# Altium project GPS_IMU.PrjPcb
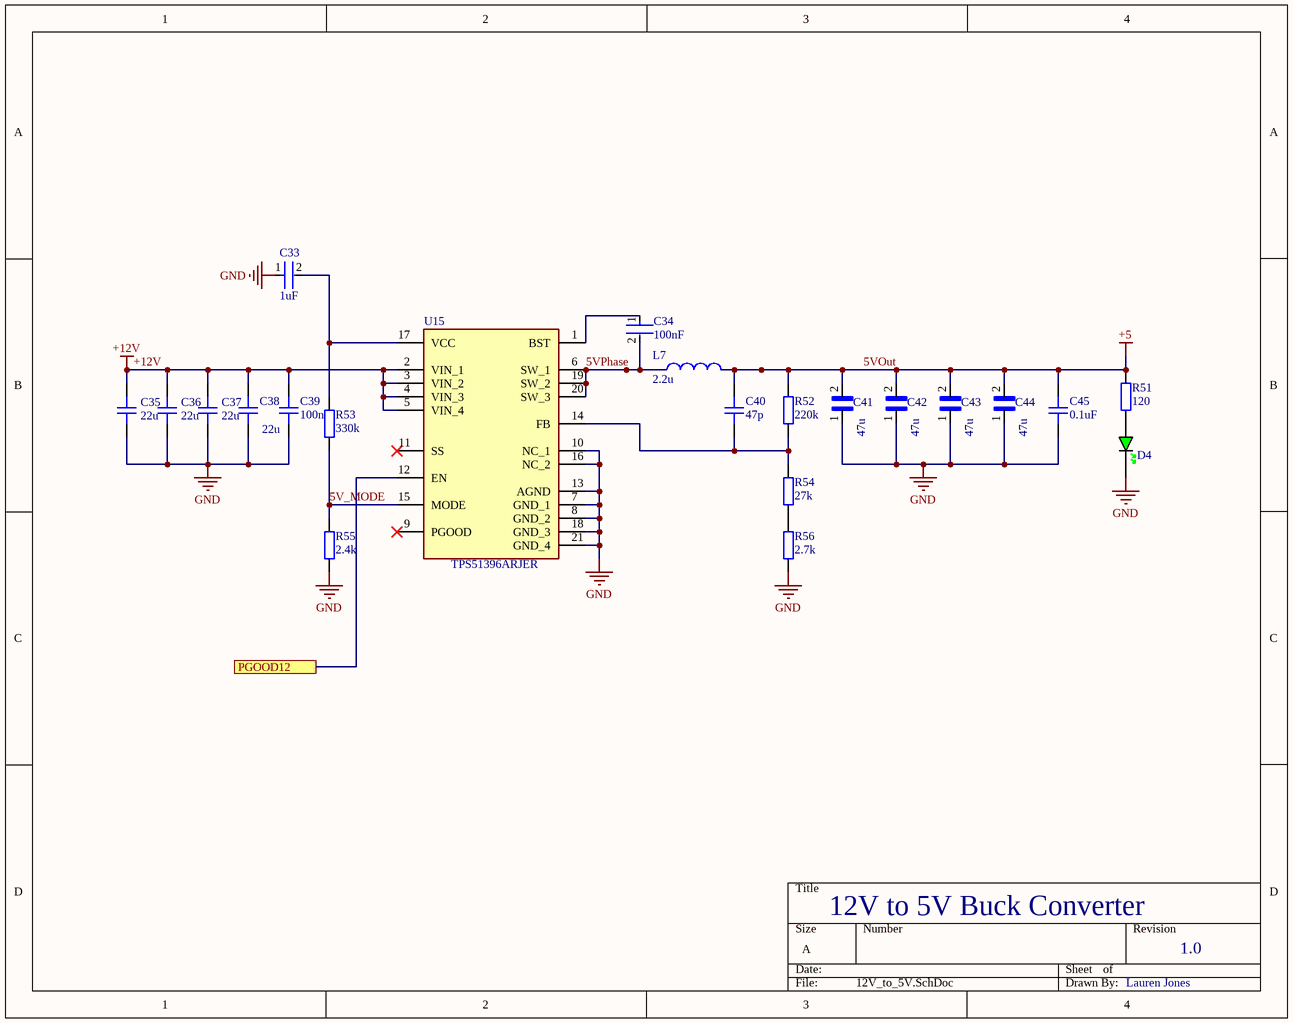
[diagram p0: 12V_to_5V.SchDoc]
5 sheets, 120 parts. Net scope: flat (ports and power ports of the same name join across sheets).
Sheets:
  12V_to_5V.SchDoc
  5V_to_3V_LDO.SchDoc
  STM32.SchDoc
  USB.SchDoc
  GPS.SchDoc

## Sheet 12V_to_5V.SchDoc
size A; SheetNumber: 1; SheetTotal: 4

### Parts
(Parts that share a designator on the sheet are numbered #1, #2 ... from top to bottom, then left to right.)
C33  1uF  [FP-CL283-IPC_C]
C34  100nF  [FP-CC0603-DA-MFG]
C35  22u  [CAP_0805]
C36  22u  [CAP_0805]
C37  22u  [CAP_0805]
C38  22u  [CAP_0805]
C39  100n  [CAP_0603]
C40  47p  [CAP_0402]
C41  47u  [CAP_CGA9N3X7R1C476M230KB]
C42  47u  [CAP_CGA9N3X7R1C476M230KB]
C43  47u  [CAP_CGA9N3X7R1C476M230KB]
C44  47u  [CAP_CGA9N3X7R1C476M230KB]
C45  0.1uF  [CAP_1206]
D4#1  GREEN  [LED_0805_GREEN]  (value not drawn)
L7  2.2u  [IND_SPM10040T-2R2M-HZ]
R51  120  [RES_0805]
R52  220k  [RES_0603]
R53  330k  [RES_0603]
R54  27k  [RES_0603]
R55  2.4k  [RES_0603]
R56  2.7k  [RES_0603]
U15  TPS51396ARJER  [TPS51396ARJER]

### Ports
PGOOD12

### Nets
5VOut: C40.2 C41.2 C42.2 C43.2 C44.2 C45.2 L7.2 R51.2 R52.2  [also labelled +5]
+12V: C35.2 C36.2 C37.2 C38.2 C39.2 U15.2(VIN_1) U15.3(VIN_2) U15.4(VIN_3) U15.5(VIN_4)
GND: C33.1 C35.1 C36.1 C37.1 C38.1 C39.1 C41.1 C42.1 C43.1 C44.1 C45.1 D4#1.K R55.1 R56.1 U15.7(GND_1) U15.8(GND_2) U15.10(NC_1) U15.13(AGND) U15.16(NC_2) U15.18(GND_3) U15.21(GND_4)
5V_MODE: R53.1 R55.2 U15.15(MODE)
5VPhase: C34.2 L7.1 U15.6(SW_1) U15.19(SW_2) U15.20(SW_3)
NetC33_2: C33.2 R53.2 U15.17(VCC)
NetC34_1: C34.1 U15.1(BST)
NetC40_1: C40.1 R52.1 R54.2 U15.14(FB)
NetD4#1_A: D4#1.A R51.1
NetR54_1: R54.1 R56.2
NetU15_12: U15.12(EN) ; port PGOOD12

Not connected (* = marked no-connect by the designer): U15 9(PGOOD)* 11(SS)*

### Notes on the sheet
- 12V to 5V Buck Converter
- 1.0
- Lauren Jones

### Library data of the parts
C33 = CMP-13271-003018-1: Cap Ceramic 4.7uF 6.3V X5R ±20% SMD 0402 +85°C Paper T/R; Lead Free: Lead Free; Voltage Rating: 6.3V; Case Code (Metric): 1005; Package Quantity: 1; Capacitance: 4.7uF; Length: 0.039inch; Mount: Surface Mount; Radiation Hardening: No; Packaging: Tape and Reel; Tolerance: 20%; Max Operating Temperature: 85°C; Width: 0.02inch; Case Code (Imperial): 0402; Thickness: 0.022inch; Min Operating Temperature: -55°C; Dielectric: X5R; Case/Package: 0402; Depth: 0.5mm
C34 = CMP-2100-03601-2: CAP CER 0.1UF 50V X7R 0603 / CC0603KRX7R9BB104; Manufacturer: YAGEO; Material: Ceramic; Temperature Coefficient: 15%; Tolerance: 0.1; Height: 0.9mm; Voltage: 50 V; ComponentLink2Description: Datasheet; Device Class L2: Capacitors; Temperature Range High: +125°C; Category: Cap; Capacitance: 100 nF; Footprint Url: http://www.yageo.com/exep/pages/download/literatures/UPY-C_GEN_24.pdf; ComponentLink2URL: http://www.yageo.com/documents/recent/UPY-GPHC_X7R_6.3V-to-50V_18.pdf; Package: CC0603-DA; Temperature: -55°C to +125°C; Voltage Rating: 50 V; Temperature Characteristic: X7R; Device Class L1: Passive Components; Temperature Range Low: -55°C; Manufacturer Part Number: CC0603KRX7R9BB104; RoHS: TRUE; Automotive: No; Value: 100 nF; Device Class L3: Ceramic Capacitors; Octopart: https://octopart.com/cc0603krx7r9bb104-yageo-42244635; Mouser Description: Multilayer Ceramic Capacitor, CC Series, 0.1 - F, - 10%, X7R, 50 V, 0603 [1608 Metric]; Lead Free: Yes; Digikey Description: CAP CER 0.1UF 50V X7R 0603
C35-C38 = CAP_0805: Capacitor SMD 0805; Manufacturer: *; Manufacturer Part Number: *; Distributor Link: *; LCSC: *; Rating: *; Dielectric: *
C39 = CAP_0603: Capacitor SMD 0603; Manufacturer: *; Manufacturer Part Number: *; Distributor Link: *; LCSC: *; Rating: *; Dielectric: *
C40 = CAP_0402: Capacitor SMD 0402; Manufacturer: *; Manufacturer Part Number: *; Distributor Link: *; LCSC: *; Rating: *; Dielectric: *
C41-C44 = CGA9N3X7R1C476M230KB: 47µF ±20% 16V Ceramic Capacitor X7R 2220 (5750 Metric); MF: TDK; SnapEDA_Link: https://www.snapeda.com/parts/CGA9N3X7R1C476M230KB/TDK/view-part/1756766/?ref=snap; MP: CGA9N3X7R1C476M230KB; Digi-Key_Part_Number: 445-7935-1-ND; Value: *; Mouser-Purchase-URL: https://snapeda.com/shop?store=Mouser&id=1756766; Package: 2220 TDK; DigiKey-Purchase-URL: https://snapeda.com/shop?store=DigiKey&id=1756766
C45 = CAP_1206: Capacitor SMD 1206; Manufacturer: *; Manufacturer Part Number: *; Distributor Link: *; LCSC: *; Rating: *; Dielectric: *
D4#1 = LED_0805_GREEN: KT-0805G; Manufacturer: *; Manufacturer Part Number: *; Distributor Link: *; LCSC: *
L7 = SPM10040T-2R2M-HZ: Inductor Power Shielded Wirewound 2.2uH 20% 100KHz Metal 16.7A 0.00748Ohm DCR Automotive T/R; MF: TDK; DigiKey_Part_Number: 445-180236-2-ND; Purchase-URL: https://pricing.snapeda.com/search?q=SPM10040T-2R2M-HZ&ref=eda; Package: NON STANDARD-2 TDK; Check_prices: https://www.snapeda.com/parts/SPM10040T-2R2M-HZ/TDK/view-part/?ref=eda; Value: *; SnapEDA_Link: https://www.snapeda.com/parts/SPM10040T-2R2M-HZ/TDK/view-part/?ref=snap; MP: SPM10040T-2R2M-HZ
R51 = RES_0805: Resistor SMD 0805; Manufacturer: *; Manufacturer Part Number: *; Distributor Link: *; LCSC: *
R52-R56 = RES_0603: Resistor SMD 0603; Manufacturer: *; Manufacturer Part Number: *; Distributor Link: *; LCSC: *
U15 = TPS51396ARJER: Buck Switching Regulator IC Positive Adjustable 0.6V 1 Output 8A 20-VFQFN Exposed Pad; Manufacturer_Name: Texas Instruments; Geometry.Height: 1mm; Mouser Part Number: 595-TPS51396ARJER; Mouser Price/Stock: https://www.mouser.co.uk/ProductDetail/Texas-Instruments/TPS51396ARJER?qs=GBLSl2AkirtKr8QWcQ0Vig%3D%3D; Manufacturer_Part_Number: TPS51396ARJER; Datasheet Link: https://www.ti.com/lit/ds/symlink/tps51396a.pdf?HQS=dis-mous-null-mousermode-dsf-pf-null-wwe&ts=1662566370253&ref_url=https%253A%252F%252Fwww.mouser.in%252F; LCSC Part #: C3032872

## Sheet 5V_to_3V_LDO.SchDoc
size A; SheetNumber: 6; SheetTotal: 7
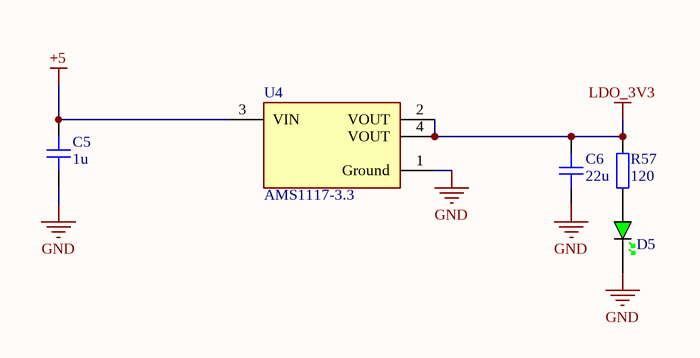
[diagram p1: 5V_to_3V_LDO.SchDoc]

### Parts
(Parts that share a designator on the sheet are numbered #1, #2 ... from top to bottom, then left to right.)
C5#1  1u  [CAP_0402]
C6#1  22u  [CAP_0402]
D5  GREEN  [LED_0805_GREEN]  (value not drawn)
R57  120  [RES_0805]
U4#1  AMS1117-3.3  [FP-AMS1117-IPC_C]

### Nets
+5: C5#1.2 U4#1.3(VIN)  [project net 5VOut]
GND: C5#1.1 C6#1.1 D5.K U4#1.1(Ground)
LDO_3V3: C6#1.2 R57.2 U4#1.2(VOUT) U4#1.4(VOUT)
NetD5_A: D5.A R57.1

### Library data of the parts
C5#1 C6#1 = CAP_0402: Capacitor SMD 0402; Manufacturer: *; Manufacturer Part Number: *; Distributor Link: *; Rating: *; Dielectric: *
  C5#1: LCSC: *; LCSC Part #: C52923
  C6#1: LCSC Part #: C1621763
D5 = LED_0805_GREEN: KT-0805G; Manufacturer: *; Manufacturer Part Number: *; Distributor Link: *; LCSC: *
R57 = RES_0805: Resistor SMD 0805; Manufacturer: *; Manufacturer Part Number: *; Distributor Link: *; LCSC: *
U4#1 = CMP-209535-000001-1: LDO Voltage Regulators 1A, 3.3V; Manufacturer: Advanced Monolithic Systems; Dropout Voltage: 1.1V; Output Type: Fixed; Nominal Supply Current: 5mA; Max Power Dissipation: 1.2W; Max Supply Voltage: 15V; Number Of Outputs: 1; Standoff Height: 0.64mm; Max Junction Temp: +125°C; Height: 1.8mm; Package: AMS1117; Device Class L2: Power Management ICs; ComponentLink2Description: Datasheet; ComponentLink2URL: http://www.advanced-monolithic.com/pdf/ds1117.pdf; Category: IC; RoHS: TRUE; Automotive: No; Device Class L1: Integrated Circuits (ICs); Output Current: 1A; Device Class L3: Voltage Regulators - Linear; Temperature: -40°C to +125°C; Output Voltage: 3.3V; Manufacturer Part Number: AMS1117-3.3; Temperature Range Low: -40°C; Octopart: https://octopart.com/ams1117-3.3-advanced+monolithic+systems-25899300; Lead Free: Yes; Ipc Land Pattern Name: SOT229P700X180-4; Temperature Range High: +125°C

## Sheet STM32.SchDoc
size 304 x 190 mm; Engineer: Morgan Jones; Revision: 1.0; SheetNumber: 3; SheetTotal: 3
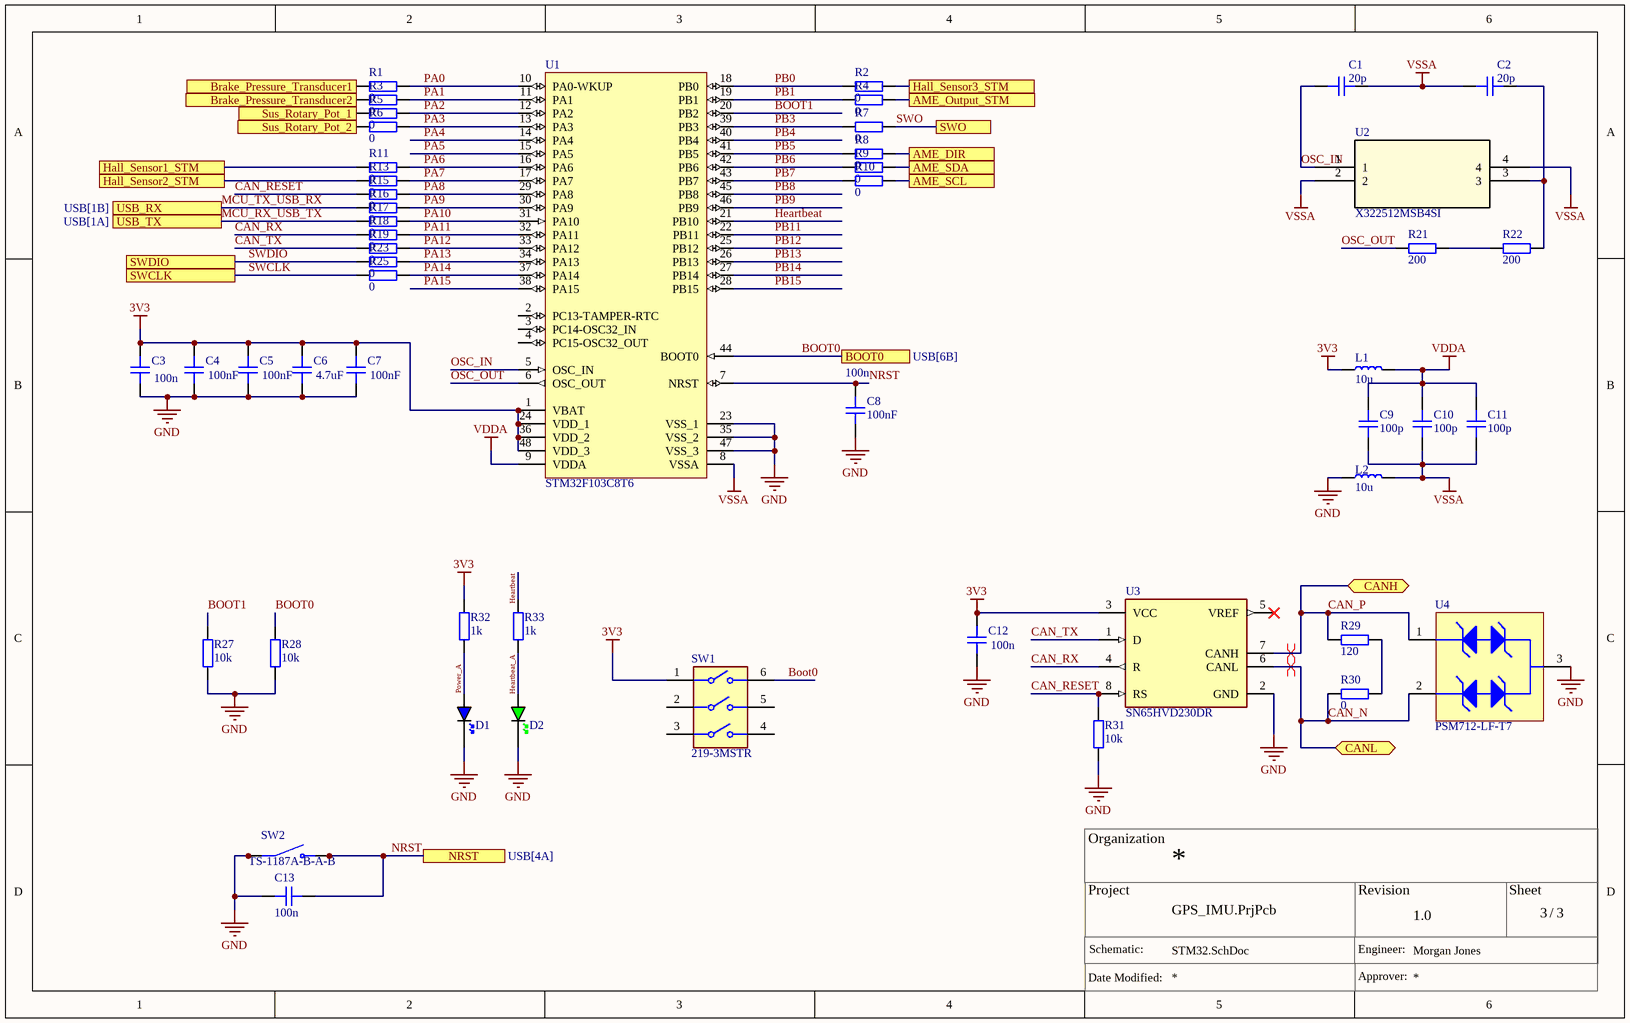
[diagram p2: STM32.SchDoc]

### Parts
(Parts that share a designator on the sheet are numbered #1, #2 ... from top to bottom, then left to right.)
C1  20p  [CAP_0402]
C2  20p  [CAP_0402]
C3  100n  [CAP_0402]
C4  Capacitance: 100nF  [CAP_0402]  (hidden comment: 100n)
C5#2  Capacitance: 100nF  [CAP_0402]  (hidden comment: 100n)
C6#2  Capacitance: 4.7uF  [CAP_0402]  (hidden comment: 4.7u)
C7  Capacitance: 100nF  [CAP_0402]  (hidden comment: 100n)
C8  100n  Capacitance: 100nF  [CAP_0402]
C9  100p  [CAP_0402]
C10  100p  [CAP_0402]
C11  100p  [CAP_0402]
C12  100n  [CAP_0402]
C13  100n  [CAP_0402]
D1  BLUE  [LED_0603_BLUE]  (value not drawn)
D2  GREEN  [LED_0603_GREEN]  (value not drawn)
L1  10u  [IND_0603]
L2  10u  [IND_0603]
R1  0  [RES_0402]
R2  0  [RES_0402]
R3  0  [RES_0402]
R4  0  [RES_0402]
R5  0  [RES_0402]
R6  0  [RES_0402]
R7  0  [RES_0402]
R8  0  [RES_0402]
R9  0  [RES_0402]
R10  0  [RES_0402]
R11  0  [RES_0402]
R13  0  [RES_0402]
R15  0  [RES_0402]
R16  0  [RES_0402]
R17  0  [RES_0402]
R18  0  [RES_0402]
R19  0  [RES_0402]
R21  200  [RES_0402]
R22  200  [RES_0402]
R23  0  [RES_0402]
R25  0  [RES_0402]
R27  10k  [RES_0402]
R28  10k  [RES_0402]
R29  120  [RES_0402]
R30  0  [RES_0402]
R31  10k  [RES_0402]
R32  1k  [RES_0402]
R33  1k  [RES_0402]
SW1  219-3MSTR  [FP-219-3MSTR-MFG]
SW2  TS-1187A-B-A-B  [SW_TS-1187A-B-A-B]
U1  STM32F103C8T6  [STM-LQFP48_M]
U2  X322512MSB4SI  [XTAL_3225]
U3  SN65HVD230DR  [FP-D0008A-IPC_A]
U4#2  PSM712-LF-T7  [PRKT-SOT23-3_V]

### Ports
AME_DIR, AME_Output_STM, AME_SCL, AME_SDA, BOOT0 (see USB[6B]), Brake_Pressure_Transducer1, Brake_Pressure_Transducer2, CANH (bidir), CANL (bidir), Hall_Sensor1_STM, Hall_Sensor2_STM, Hall_Sensor3_STM, NRST (see USB[4A]), Sus_Rotary_Pot_1, Sus_Rotary_Pot_2, SWCLK, SWDIO, SWO, USB_RX (see USB[1B]), USB_TX (see USB[1A])

### Nets
3V3: C3.2 C4.2 C5#2.1 C6#2.2 C7.2 C12.2 L1.1 R32.1 SW1.1 U1.1(VBAT) U1.24(VDD_1) U1.36(VDD_2) U1.48(VDD_3) U3.3(VCC)
GND: C3.1 C4.1 C5#2.2 C6#2.1 C7.1 C8.1 C12.1 C13.1 D1.K D2.K L2.1 R27.2 R28.2 R31.1 SW2.A(COM) SW2.B(COM) U1.23(VSS_1) U1.35(VSS_2) U1.47(VSS_3) U3.2(GND) U4#2.3
VDDA: C9.2 C10.2 C11.2 L1.2 U1.9(VDDA)
VSSA: C1.2 C2.1 C9.1 C10.1 C11.1 L2.2 U1.8(VSSA) U2.2 U2.4
BOOT0: R28.1 SW1.6 U1.44(BOOT0) ; port BOOT0
BOOT1: R27.1 U1.20(PB2)
CAN_N: R30.1 U3.6(CANL) U4#2.2 ; port CANL
CAN_P: R29.2 U3.7(CANH) U4#2.1 ; port CANH
CAN_RESET: R15.2 R31.2 U3.8(RS)
CAN_RX: R18.2 U3.4(R)
CAN_TX: R19.2 U3.1(D)
Heartbeat: R33.1 U1.21(PB10)
Heartbeat_A: D2.A R33.2
MCU_RX_USB_TX: R17.2 ; port USB_TX
MCU_TX_USB_RX: R16.2 ; port USB_RX
NRST: C8.2 C13.2 SW2.C(NO) SW2.D(NO) U1.7(NRST) ; port NRST
OSC_IN: C1.1 U1.5(OSC_IN) U2.1
OSC_OUT: R21.2 U1.6(OSC_OUT)
PA0: R1.2 U1.10(PA0-WKUP)
PA1: R3.2 U1.11(PA1)
PA2: R5.1 U1.12(PA2)
PA3: R6.2 U1.13(PA3)
PA4: U1.14(PA4)
PA5: U1.15(PA5)
PA6: R11.1 U1.16(PA6)
PA7: R13.1 U1.17(PA7)
PA8: R15.1 U1.29(PA8)
PA9: R16.1 U1.30(PA9)
PA10: R17.1 U1.31(PA10)
PA11: R18.1 U1.32(PA11)
PA12: R19.1 U1.33(PA12)
PA13: R23.1 U1.34(PA13)
PA14: R25.1 U1.37(PA14)
PA15: U1.38(PA15)
PB0: R2.1 U1.18(PB0)
PB1: R4.1 U1.19(PB1)
PB3: R7.1 U1.39(PB3)
PB4: U1.40(PB4)
PB5: R8.2 U1.41(PB5)
PB6: R9.2 U1.42(PB6)
PB7: R10.2 U1.43(PB7)
PB8: U1.45(PB8)
PB9: U1.46(PB9)
PB11: U1.22(PB11)
PB12: U1.25(PB12)
PB13: U1.26(PB13)
PB14: U1.27(PB14)
PB15: U1.28(PB15)
Power_A: D1.A R32.2
SWCLK: R25.2 ; port SWCLK
SWDIO: R23.2 ; port SWDIO
SWO: R7.2 ; port SWO
NetC2_2: C2.2 R22.2 U2.3
NetR1_1: R1.1 ; port Brake_Pressure_Transducer1
NetR2_2: R2.2 ; port Hall_Sensor3_STM
NetR3_1: R3.1 ; port Brake_Pressure_Transducer2
NetR4_2: R4.2 ; port AME_Output_STM
NetR5_2: R5.2 ; port Sus_Rotary_Pot_1
NetR6_1: R6.1 ; port Sus_Rotary_Pot_2
NetR8_1: R8.1 ; port AME_DIR
NetR9_1: R9.1 ; port AME_SDA
NetR10_1: R10.1 ; port AME_SCL
NetR11_2: R11.2 ; port Hall_Sensor1_STM
NetR13_2: R13.2 ; port Hall_Sensor2_STM
NetR21_1: R21.1 R22.1
NetR29_1: R29.1 R30.2

Not connected (* = marked no-connect by the designer): SW1 2 3 4 5; U1 2(PC13-TAMPER-RTC) 3(PC14-OSC32_IN) 4(PC15-OSC32_OUT); U3 5(VREF)*

### Layout directives
differential pair; differential pair class DIFF_CAN: CAN_N, CAN_P

### Notes on the sheet
- Organization
- Project
- Revision
- Sheet
- Schematic:
- Engineer:
- /
- Date Modified:
- Approver:

### Library data of the parts
C1 C2 C4 C5#2 C6#2 C7-C11 C13 = CAP_0402: Capacitor SMD 0402; Manufacturer: *; Manufacturer Part Number: *; Distributor Link: *; Rating: *; Dielectric: *
  C1 C2: LCSC Part #: C1554; Capacitance: 20p
  C4 C5#2 C7 C8 C13: LCSC Part #: C307331
  C6#2: LCSC Part #: C23733
  C9-C11: LCSC Part #: C1546
C3 C12 = CAP_0402: Capacitor SMD 0402; Capacitance: 100nF; Manufacturer: *; Manufacturer Part Number: *; Distributor Link: *; LCSC Part #: C307331; Rating: *; Dielectric: *
D1 = LED_0603_BLUE: LED 0603 BLUE SMD; LCSC Part #: C72041
D2 = LED_0603_GREEN: LED 0603 GREEN SMD; LCSC Part #: C72043
L1 L2 = IND_0603: Inductor SMD 0603; LCSC Part #: C1035
R1-R11 R13 R15-R19 R21-R23 R25 R27-R33 = RES_0402: Resistor SMD 0402; Manufacturer: *; Manufacturer Part Number: *; Distributor Link: *
  R1-R11 R13 R15-R19 R23 R25: LCSC Part #: C17168
  R21 R22: LCSC Part #: C25087
  R27 R28: LCSC Part #: C25744; Resistance: 10k
  R29: LCSC Part #: C25079; Resistance: 120
  R30: LCSC Part #: C17168; Resistance: 0
  R31: LCSC Part #: C25744
  R32 R33: LCSC Part #: C11702
SW1 = CMP-07018-000004-1: SWITCH SLIDE DIP SPST 100MA 20V; Washable: Yes; Mechanical Life: 2000Cycles; Number of Positions: 3; Pitch: 0.1inch; Actuator Type: Slide (Standard); Max Operating Temperature: 85°C; Voltage Rating (DC): 20V; Termination: Gull Wing; Length: 0.358inch; Min Operating Temperature: -55°C; Orientation: Straight; Mount: Surface Mount; Package Quantity: 1000; Current Rating: 100mA; Electrical Life: 2000Cycles; Max Current Rating: 100mA; Throw Configuration: SPST; Contact Material: Copper; Packaging: Tape and Reel; Contact Plating: Gold; Lead Free: Lead Free; Max Voltage Rating (DC): 20V; LCSC Part #: C3012353
SW2 = TS-1187A-B-A-B: SPST 50mA @ 12VDC Top Actuated Round Button 160gf SMD Tactile Switches RoHS; MP: TS-1187A-B-A-B; Value: *; Price: None; Package: None; Availability: Unavailable; LCSC Part #: C318884
U1 = CMP-0237-00303-2: ARM Cortex-M3 32-bit MCU, 64 KB Flash, 20 KB Internal RAM, 37 I/Os, 48-Pin LQFP, -40 to 105 degC, Tape and Reel; Manufacturer: STMicroelectronics; PartNumber: STM32F103C8T7TR; Operating Frequency(F) (Processor speed) (MHz): 72; Supply Voltage(Vcc) min (V): 2; FLASH Size (Prog) (kB): 64; Internal RAM Size (kB): 20; I/Os (High Current): 36; Package Reference: LQFP48; ComponentLink2Description: Datasheet; ComponentLink2URL: http://www.st.com/st-web-ui/static/active/en/resource/technical/document/datasheet/CD00161566.pdf; ComponentLink1URL: http://www.st.com/; Packing: Tape and Reel; ComponentLink1Description: Manufacturer URL; DatasheetVersion: Rev. 17; Core: ARM Cortex-M3; Mounting Technology: Surface Mount; Package Description: 48-Pin Low Profile Quad Flat Package, Body 7 x 7 mm, Pitch 0.5 mm; LCSC Part #: C8734
U2 = X322512MSB4SI: No Description Available; Mfr_Name: YXC; Copyright: Copyright (C) 2023 Ultra Librarian. All rights reserved.; Manufacturer_Part_Number: X322512MSB4SI; RefDes: RefDes; Type: DEV; LCSC Part #: C9002
U3 = CMP-0315-00015-3: IC TRANSCEIVER HALF 1/1 8SOIC; Number of Transceivers: 1; Operating Supply Voltage: 3.3V; Number of I/Os: 2; Max Supply Current: 17mA; Max Supply Voltage: 3.6V; Min Supply Voltage: 3V; Data Rate: 1Mbps; Min Operating Temperature: -40°C; Packaging: Tape and Reel; Lead Free: Lead Free; Number of Transmit Buffers: 1; Max Operating Temperature: 85°C; Number of Receive Buffers: 1; Number of Pins: 8; Package Quantity: 1; Radiation Hardening: No; Case/Package: D; REACH SVHC: No SVHC; Weight: 0.002561oz; Termination: SMD/SMT; Contact Plating: Gold; Nominal Supply Current: 17mA; Number of Receivers: 1; Number of Drivers: 1; LCSC Part #: C5342107
U4#2 = CMP-2000-07553-1: TVS Array - Asymmetrical Data Line Protector, 600 W, 7.5 V, -55 to 150 degC, 3-Pin SOT23, RoHS, Tape and Reel; Manufacturer: Protek Devices; Min Breakdown Voltage: 7.5V; Direction: Bidirectional; Capacitance: 75pF; Current: 20uA; Power Dissipation: 600W; Working Voltage: 7V; Voltage: 12V; Case\/Package: SOT-23; Clamping Voltage: 17V; Element Configuration: Dual; Mounting Technology: SurfaceMount; RoHSCompliant: True; Radiation Hardening: No; Depth: 1.4mm; Lead Free: LeadFree; Package Description: 3-Pin Small Outline Transistor, Body 2.92 x 1.3 mm, Pitch 0.94 mm; Max Operating Temperature: 150degC; Length: 3.04mm; Manufacturer URL: http://www.protekdevices.com/; Min Operating Temperature: -55degC; Leakage Current: 20uA; Datasheet URL: www.protekdevices.com/xyz/documents/datasheets/psm712.pdf; Packaging: TapeandReel; Datasheet Version: 10/2013; Package Reference: SOT23-3; Number of Pins: 3; LCSC Part #: C32677

## Sheet USB.SchDoc
size 304 x 190 mm; SheetNumber: 4; SheetTotal: 4
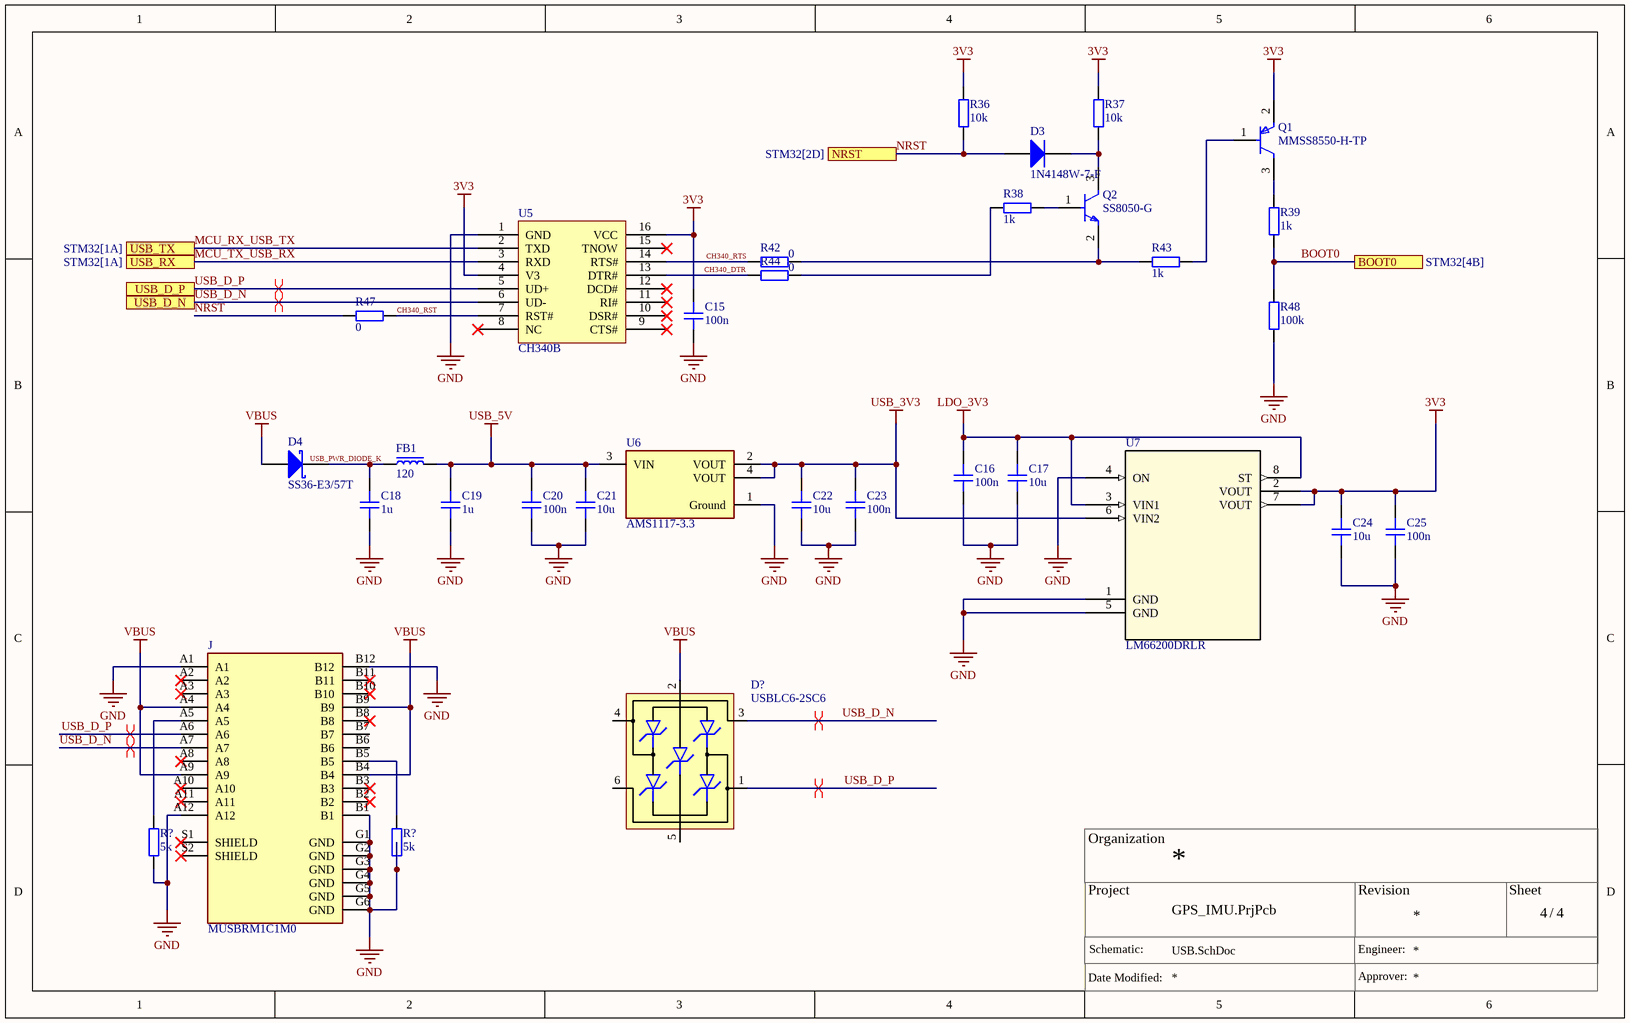
[diagram p3: USB.SchDoc]

### Parts
(Parts that share a designator on the sheet are numbered #1, #2 ... from top to bottom, then left to right.)
C15  100n  [CAP_0402]
C16  100n  [CAP_0402]
C17  10u  [CAP_0402]
C18  1u  [CAP_0402]
C19  1u  [CAP_0402]
C20  100n  [CAP_0402]
C21  10u  [CAP_0402]
C22  10u  [CAP_0402]
C23  100n  [CAP_0402]
C24  10u  [CAP_0402]
C25  100n  [CAP_0402]
D3  1N4148W-7-F  [DIOD-SOD123-2_V]
D4#2  SS36-E3/57T  [VISH-DO-214AB-2_V]
D?  USBLC6-2SC6  [SOT-23-6]
FB1  120  [FB_0603]
J  MUSBRM1C1M0  [AMPHENOL_MUSBRM1C1M0]
Q1  MMSS8550-H-TP  [FP-SOT-23-IPC_B]
Q2  SS8050-G  [FP-SS8050-G-MFG]
R36  10k  [RES_0402]
R37  10k  [RES_0402]
R38  1k  [RES_0402]
R39  1k  [RES_0402]
R42  0  [RES_0402]
R43  1k  [RES_0402]
R44  0  [RES_0402]
R47  0  [RES_0402]
R48  100k  [RES_0402]
R?#1  5k  [RES_0402]
R?#2  5k  [RES_0402]
U5  CH340B  [CH340B]
U6  AMS1117-3.3  [FP-AMS1117-IPC_C]
U7  LM66200DRLR  [SOT-5X3_DRL_TEX]

### Ports
BOOT0 (see STM32[4B]), NRST (see STM32[2D]), USB_D_N, USB_D_P, USB_RX (see STM32[1A]), USB_TX (see STM32[1A])

### Nets
3V3: C15.2 C24.2 C25.2 Q1.2(E) R36.2 R37.2 U5.4(V3) U5.16(VCC) U7.2(VOUT) U7.7(VOUT)
GND: C15.1 C16.1 C17.1 C18.1 C19.1 C20.1 C21.1 C22.1 C23.1 C24.1 C25.1 J.A1 J.A12 J.B1 J.B12 J.G1(GND) J.G2(GND) J.G3(GND) J.G4(GND) J.G5(GND) J.G6(GND) R48.1 R?#1.1 R?#2.1 U5.1(GND) U6.1(Ground) U7.1(GND) U7.4(ON) U7.5(GND)
LDO_3V3: C16.2 C17.2 U7.3(VIN1) U7.8(ST)
USB_3V3: C22.2 C23.2 U6.2(VOUT) U6.4(VOUT) U7.6(VIN2)
USB_5V: C19.2 C20.2 C21.2 FB1.2 U6.3(VIN)
VBUS: D4#2.1(A) D?.2(GND) J.A4 J.A9 J.B4 J.B9
BOOT0: R39.1 R48.2 ; port BOOT0
CH340_DTR: R44.1 U5.13(DTR#)
CH340_RST: R47.2 U5.7(RST#)
CH340_RTS: R42.1 U5.14(RTS#)
MCU_RX_USB_TX: U5.2(TXD) ; port USB_TX
MCU_TX_USB_RX: U5.3(RXD) ; port USB_RX
NRST: D3.1(A) R36.1 R47.1 ; port NRST
USB_D_N: D?.3(IO2) J.A7 U5.6(UD-) ; port USB_D_N
USB_D_P: D?.1(IO1) J.A6 U5.5(UD+) ; port USB_D_P
USB_PWR_DIODE_K: C18.2 D4#2.2(K) FB1.1
NetD3_2: D3.2(K) Q2.3(C) R37.1
NetJ_A5: J.A5 R?#1.2
NetJ_B5: J.B5 R?#2.2
NetQ1_1: Q1.1(B) R43.2
NetQ1_3: Q1.3(C) R39.2
NetQ2_1: Q2.1(B) R38.2
NetQ2_2: Q2.2(E) R42.2 R43.1
NetR38_1: R38.1 R44.2

Not connected (* = marked no-connect by the designer): D? 4(IO2) 5(VBUS) 6(IO1); J A2* A3* A8* A10* A11* B2* B3* B6 B7 B8* B10* B11* S1(SHIELD)* S2(SHIELD)*; U5 8(NC)* 9(CTS#)* 10(DSR#)* 11(RI#)* 12(DCD#)* 15(TNOW)*

### Layout directives
differential pair: USB_D_N, USB_D_P

### Notes on the sheet
- Organization
- Project
- Revision
- Sheet
- Schematic:
- Engineer:
- /
- Date Modified:
- Approver:

### Library data of the parts
C15-C25 = CAP_0402: Capacitor SMD 0402; Manufacturer: *; Manufacturer Part Number: *; Distributor Link: *; Rating: *; Dielectric: *
  C15 C16 C20 C23 C25: LCSC Part #: C307331
  C17 C21 C22 C24: LCSC Part #: C15525
  C18 C19: LCSC Part #: C52923
D3 = CMP-2000-04932-2: Fast Switching Diode, 100 V, 0.15 A, -65 to 150 degC, 2-Pin?SOD123, RoHS, Tape and Reel; Recovery Time: 4ns; Brand: DiodesIncorporated; Unit Weight: 0.000353oz; Max Surge Current: 2A; Peak Reverse Voltage: 100V; Ir - Reverse Current: 1uA; Vf - Forward Voltage: 1.25V; Configuration: Single; If - Forward Current: 0.15A; Product Category: Diodes-GeneralPurpose,Power,Switching; Operating Temperature Range: -65Cto+150C; Packaging: Reel; Manufacturer URL: http://www.diodes.com/; Maximum Operating Temperature: +150C; Height: 1.25mm; Minimum Operating Temperature: -65C; Product: SwitchingDiodes; Package URL: http://www.diodes.com/datasheets/ds18004.pdf; Type: SwitchingDiode; Package Reference: SOD123-2; Width: 1.7mm; Datasheet URL: http://www.farnell.com/datasheets/1915529.pdf; Datasheet Version: Rev. 24-2, 10/2013; Series: 1N4148; Factory Pack Quantity: 3000; Length: 2.85mm; RoHS: True; Manufacturer: DiodesIncorporated; Mounting Style: SMD/SMT; Package / Case: SOD-123; LCSC Part #: C83528
D4#2 = CMP-2000-07150-1: Surface Mount Schottky Barrier Rectifier, 60 V, 3 A, -55 to 150 degC, 2-Pin SMC (DO-214AB), RoHS, Tape and Reel; Manufacturer: Vishay; Forward Current If(AV): 3A; Diode Configuration: Single; Forward Surge Current Ifsm Max: 100A; SVHC: ToBeAdvised; No. of Pins: 2Pins; Forward Voltage VF Max: 750mV; Repetitive Reverse Voltage Vrrm Max: 60V; Datasheet URL: http://www.vishay.com/docs/88751/ss32.pdf; Datasheet Version: 08/2015; Manufacturer URL: http://www.vishay.com/; Diode Type: Schottky; Package Reference: DO-214AB; Mounting Technology: SurfaceMount; Diode Case Style: DO-214AB; Package Description: 2-Pin Surface Mount Device, Body 6.855 x 5.905 mm; Packaging: CutTape; Operating Temperature Max: 150°C; Product Range: -; LCSC Part #: C35722
D? = USBLC6-2SC6: Low-Capacitance ESD Protection USB; Manufacturer: STMicroelectronics; Manufacturer Part Number: USBLC6-2SC6; Distributor Link: https://www.mouser.de/ProductDetail/STMicroelectronics/USBLC6-2SC6?qs=po45yt2pPpu%2FhNIlwQdTlg%3D%3D
FB1 = FB_0603: Ferrite Bead SMD 0603; Manufacturer: *; Manufacturer Part Number: *; Distributor Link: *; LCSC Part #: C2661432
J = MUSBRM1C1M0: USB-C _USB TYPE-C_ Receptacle Connector 24 Position Panel Mount, Through Hole, Right Angle; MF: Amphenol ICC; SnapEDA_Link: https://www.snapeda.com/parts/MUSBRM1C1M0/Amphenol%20FCI/view-part/3662036/?ref=snap; MP: MUSBRM1C1M0; Price: None; Value: *; Availability: Unavailable; Package: None
Q1 = CMP-56214-000002-1: TRANS PNP 25V 1.5A SOT23; Emitter Base Voltage (VEBO): 1.6V; Collector Base Voltage (VCBO): 40V; Collector Emitter Saturation Voltage: 500mV; Max Power Dissipation: 625mW; Transition Frequency: 100MHz; Element Configuration: Single; hFE Min: 40; Polarity: PNP; Lead Free: Lead Free; Max Breakdown Voltage: 25V; Package Quantity: 1; Min Operating Temperature: -55°C; Case/Package: SOT-23; Max Collector Current: 1.5A; Mount: Surface Mount; Packaging: Tape and Reel; Collector Emitter Voltage (VCEO): 500mV; Max Operating Temperature: 150°C; Gain Bandwidth Product: 100MHz; Collector Emitter Breakdown Voltage: 25V; LCSC Part #: C8542
Q2 = CMP-20235-000001-1: NPN TRANSISTOR 1.5A 40V SOT-23 R; Transition Frequency: 100MHz; Max Breakdown Voltage: 25V; Collector Emitter Voltage (VCEO): 400mV; Max Power Dissipation: 300mW; Max Collector Current: 1.5A; Case/Package: TO-236-3; Packaging: Tape and Reel; RoHS Compliant: Yes; Mount: Surface Mount; Collector Emitter Breakdown Voltage: 25V; LCSC Part #: C2150
R36-R39 R42-R44 R47 R48 R?#1 R?#2 = RES_0402: Resistor SMD 0402; Manufacturer: *; Manufacturer Part Number: *; Distributor Link: *
  R36: LCSC part #: C25744
  R37: LCSC Part #: C25744
  R38 R39 R43: LCSC Part #: C11702
  R42 R44 R47: LCSC Part #: C17168
  R48: LCSC Part #: C25741
  R?#1 R?#2: LCSC Part #: C25900
U6 = CMP-209535-000001-1: as U4#1 on sheet 5V_to_3V_LDO; Height: 1.8mm; Package: AMS1117; Device Class L2: Power Management ICs; ComponentLink2Description: Datasheet; ComponentLink2URL: http://www.advanced-monolithic.com/pdf/ds1117.pdf; Category: IC; RoHS: TRUE; Automotive: No; Device Class L1: Integrated Circuits (ICs); Output Current: 1A; Device Class L3: Voltage Regulators - Linear; Temperature: -40°C to +125°C; Output Voltage: 3.3V; Manufacturer Part Number: AMS1117-3.3; Temperature Range Low: -40°C; Octopart: https://octopart.com/ams1117-3.3-advanced+monolithic+systems-25899300; Lead Free: Yes; Ipc Land Pattern Name: SOT229P700X180-4; Temperature Range High: +125°C; LCSC Part #: C6186
U7 = LM66200DRLR: No Description Available; Mfr_Name: Texas Instruments; Copyright: Copyright (C) 2023 Ultra Librarian. All rights reserved.; Manufacturer_Part_Number: LM66200DRLR; RefDes: RefDes; Type: DEV; LCSC Part #: C3235556
U5 = CH340B: LCSC Part #: C81010

## Sheet GPS.SchDoc
size A; SheetNumber: 5; SheetTotal: 5
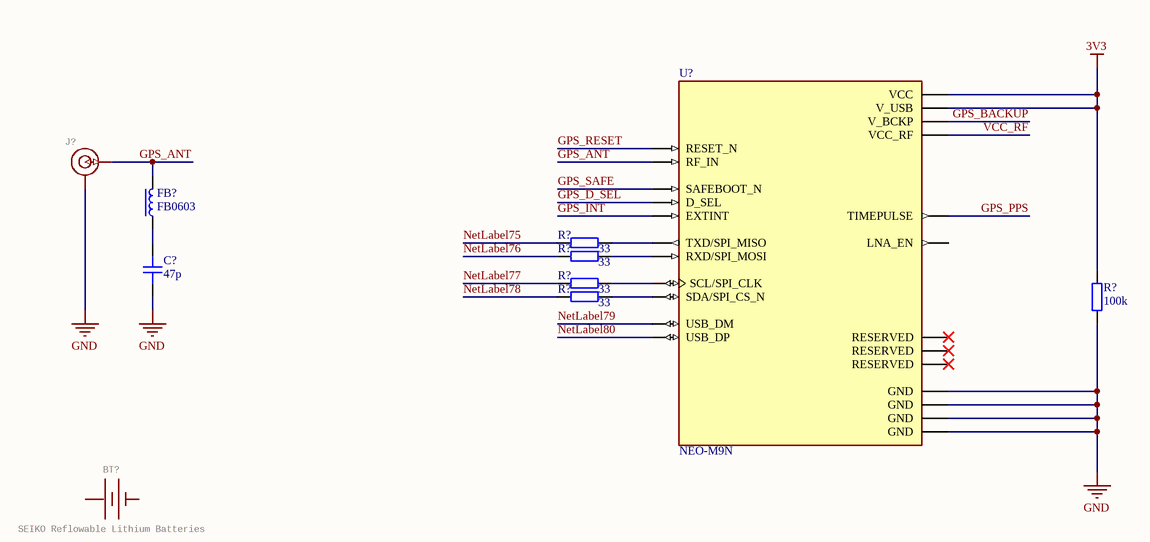
[diagram p4: GPS.SchDoc]

### Parts
(Parts that share a designator on the sheet are numbered #1, #2 ... from top to bottom, then left to right.)
BT?  SEIKO Reflowable Lithium Batteries  [ML414H_IV01E]
C?  47p  [CAP_0603]
FB?  FB0603  [FB_0603]
J?  SMD Antenna Connector - U.FL    2mm height, 3.0mm x 3.0mm receptacle size.    SparkFun Products: SparkFun WiFi Shield - ESP8266  SparkFun ESP8266 Thing  SparkFun MiniGen - Pro Mini Signal Generator Shield  [U-FL]  (value not drawn)
R?#3  33  [RES_0402]
R?#4  33  [RES_0402]
R?#5  33  [RES_0402]
R?#6  33  [RES_0402]
R?#7  100k  [RES_0402]
U?  NEO-M9N  [XCVR_NEO-M9N]

### Nets
3V3: R?#7.2 U?.7(V_USB) U?.23(VCC)
GND: C?.1 J?.1,2(GND) R?#7.1 U?.10(GND) U?.12(GND) U?.13(GND) U?.24(GND)
GPS_ANT: FB?.2 J?.FEED(SIGNAL) U?.11(RF_IN)
GPS_BACKUP: U?.22(V_BCKP)
GPS_D_SEL: U?.2(D_SEL)
GPS_INT: U?.4(EXTINT)
GPS_PPS: U?.3(TIMEPULSE)
GPS_RESET: U?.8(RESET_N)
GPS_SAFE: U?.1(SAFEBOOT_N)
NetLabel75: R?#3.1
NetLabel76: R?#4.1
NetLabel77: R?#5.1
NetLabel78: R?#6.1
NetLabel79: U?.5(USB_DM)
NetLabel80: U?.6(USB_DP)
VCC_RF: U?.9(VCC_RF)
NetC?_2: C?.2 FB?.1
NetR?#3_2: R?#3.2 U?.20(TXD/SPI_MISO)
NetR?#4_2: R?#4.2 U?.21(RXD/SPI_MOSI)
NetR?#5_2: R?#5.2 U?.19(SCL/SPI_CLK)
NetR?#6_2: R?#6.2 U?.18(SDA/SPI_CS_N)

Not connected (* = marked no-connect by the designer): BT? + -; U? 14(LNA_EN) 15(RESERVED)* 16(RESERVED)* 17(RESERVED)*

### Library data of the parts
BT? = RELOWABLE_BATTERY_ML414H: GateName_1: G$1; PROD_ID: BATT-14267; SymbolName_1: BATTERY; DeviceName: _ML414H; LibraryName: SparkFun-Batteries; DeviceSetName: RELOWABLE_BATTERY; Package: ML414H_IV01E
C? = CAP_0603: Capacitor SMD 0603; Manufacturer: *; Manufacturer Part Number: *; Distributor Link: *; LCSC: *; Rating: *; Dielectric: *
FB? = FB_0603: Ferrite Bead SMD 0603; Manufacturer: *; Manufacturer Part Number: *; Distributor Link: *; LCSC: *
J? = U.FL2PIN: GateName_1: J1; SymbolName_1: U.FL-1; PROD_ID: CONN-09193; SF_ID: WRL-09144; LibraryName: SparkFun-Connectors; DeviceSetName: U.FL2PIN; Package: U.FL
R?#3-R?#7 = RES_0402: Resistor SMD 0402; Manufacturer: *; Manufacturer Part Number: *; Distributor Link: *; LCSC: *
U? = NEO-M9N: series RF Receiver BeiDou, Galileo, GLONASS, GNSS, GPS - -167dBm - - Module; MF: U-Blox; Value: *; MP: NEO-M9N; SnapEDA_Link: https://www.snapeda.com/parts/NEO-M9N/u-blox/view-part/?ref=snap; Availability: In Stock; Package: SMD-24 u-blox; Check_prices: https://www.snapeda.com/parts/NEO-M9N/u-blox/view-part/?ref=eda; Price: None; Purchase-URL: https://pricing.snapeda.com/search/part/NEO-M9N/?ref=eda

## Nets that join several sheets
3V3: STM32 (14 pins), USB (10 pins), GPS (R?#7.2 U?.7 U?.23)
5VOut: 12V_to_5V (9 pins), 5V_to_3V_LDO (C5#1.2 U4#1.3)
GND: 12V_to_5V (21 pins), 5V_to_3V_LDO (C5#1.1 C6#1.1 D5.K U4#1.1), STM32 (21 pins), USB (29 pins), GPS (7 pins)
LDO_3V3: 5V_to_3V_LDO (C6#1.2 R57.2 U4#1.2 U4#1.4), USB (C16.2 C17.2 U7.3 U7.8)
BOOT0: STM32 (R28.1 SW1.6 U1.44), USB (R39.1 R48.2)
MCU_RX_USB_TX: STM32 (R17.2), USB (U5.2)
MCU_TX_USB_RX: STM32 (R16.2), USB (U5.3)
NRST: STM32 (5 pins), USB (D3.1 R36.1 R47.1)